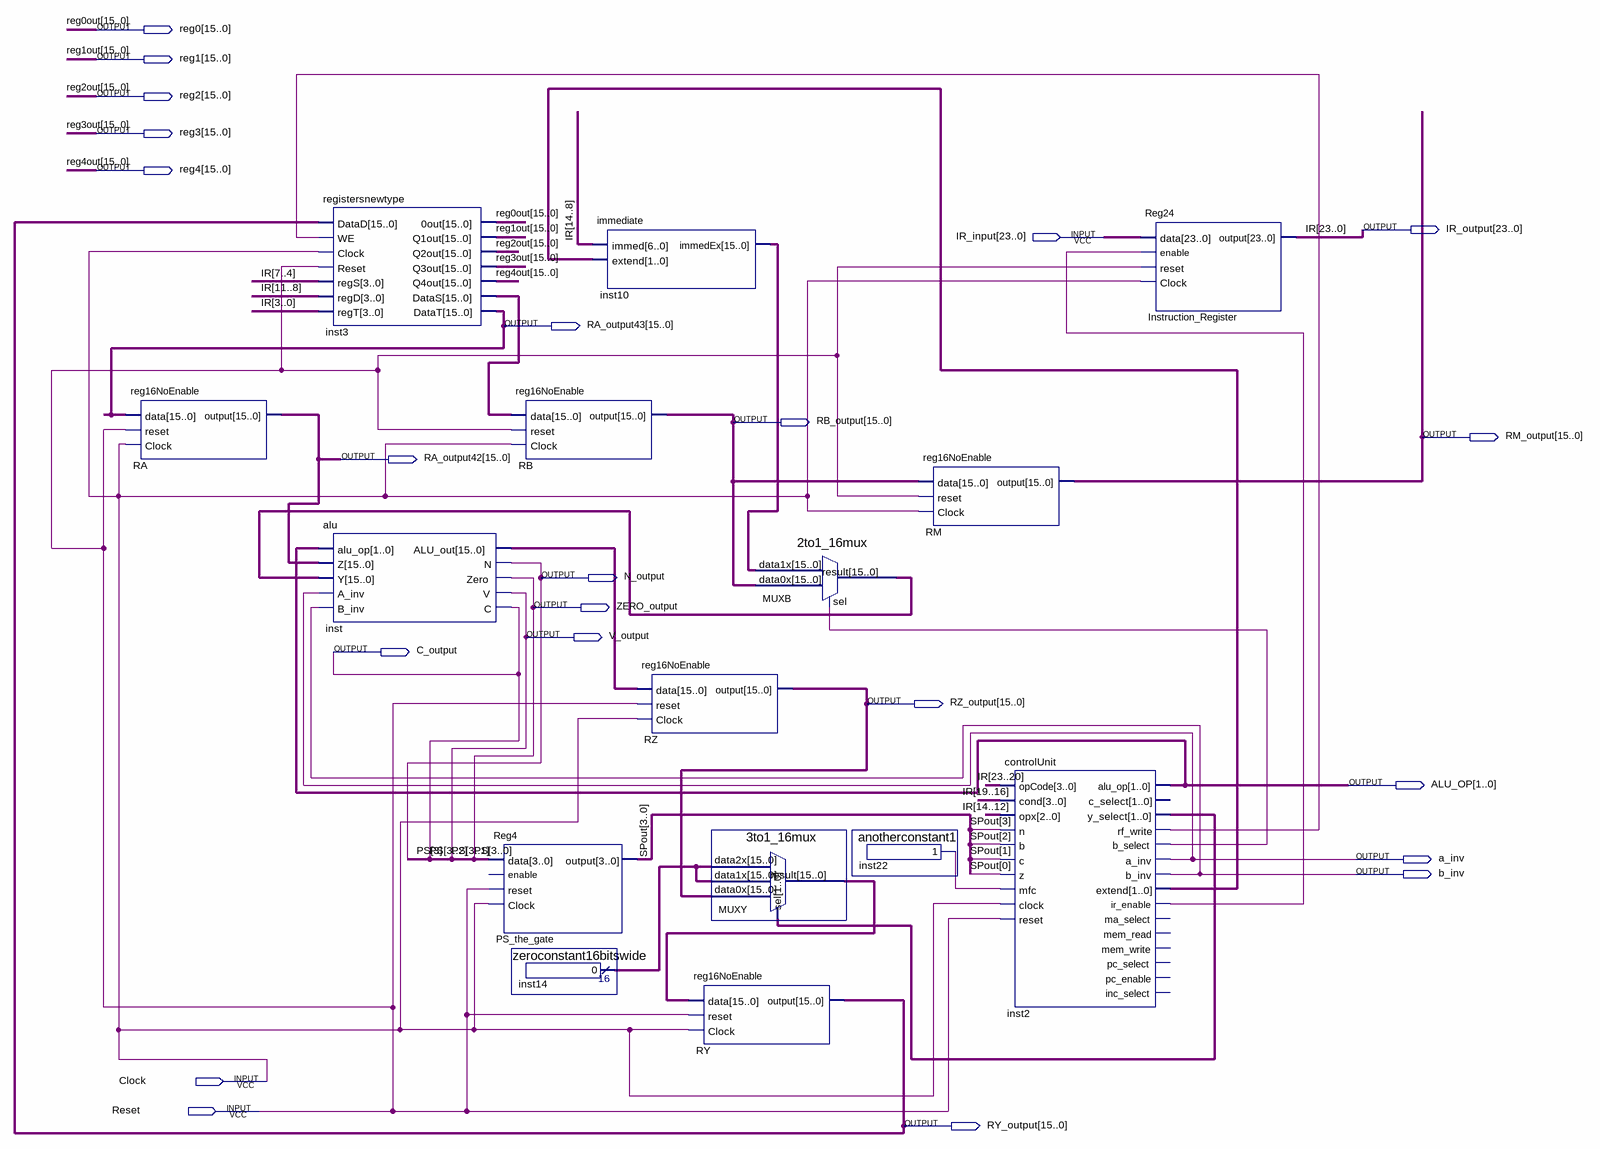
[diagram p0: schematic sheet]
// Quartus schematic ProjectMid.bdf as structural Verilog: 15 symbols, 22 pins
module ProjectMid (
  input  [23:0] IR_input,
  input  Clock,
  input  Reset,
  output [15:0] reg0,
  output [15:0] reg1,
  output [15:0] reg2,
  output [15:0] reg3,
  output [15:0] reg4,
  output [23:0] IR_output,
  output [15:0] RA_output43,
  output [15:0] RB_output,
  output [15:0] RM_output,
  output [15:0] RA_output42,
  output N_output,
  output ZERO_output,
  output V_output,
  output C_output,
  output [15:0] RZ_output,
  output [1:0] ALU_OP,
  output a_inv,
  output b_inv,
  output [15:0] RY_output
);

  wire inst2_b_select, inst2_ir_enable, inst2_rf_write, inst22_result;
  wire [1:0] inst2_extend, inst2_y_select;
  wire [3:0] PS, SPout;
  wire [15:0] inst3_datas, inst10_immedex, inst14_result, inst_alu_out, MUXB_result, MUXY_result;

  reg16NoEnable RA (.data(RA_output43), .reset(Reset), .Clock(Clock), .\output (RA_output42));
  registersnewtype inst3 (
    .DataD(RY_output), .WE(inst2_rf_write), .Clock(Clock), .Reset(Reset), .regS(IR_output[7:4]),
    .regD(IR_output[11:8]), .regT(IR_output[3:0]), .\0out (reg0), .Q1out(reg1), .Q2out(reg2), .Q3out(reg3),
    .Q4out(reg4), .DataS(inst3_datas), .DataT(RA_output43));
  alu inst (
    .alu_op(ALU_OP), .Z(RA_output42), .Y(MUXB_result), .A_inv(a_inv), .B_inv(b_inv), .ALU_out(inst_alu_out),
    .N(N_output), .Zero(ZERO_output), .V(V_output), .C(C_output));
  Reg4 PS_the_gate (.data(PS), .reset(Reset), .Clock(Clock), .\output (SPout));  // open: enable
  reg16NoEnable RB (.data(inst3_datas), .reset(Reset), .Clock(Clock), .\output (RB_output));
  zeroconstant16bitswide inst14 (.result(inst14_result));
  immediate inst10 (.immed(IR_output[14:8]), .extend(inst2_extend), .immedEx(inst10_immedex));
  reg16NoEnable RZ (.data(inst_alu_out), .reset(Reset), .Clock(Clock), .\output (RZ_output));
  \3to1_16mux  MUXY (
    .data2x(inst14_result), .data1x(inst14_result), .data0x(RZ_output), .sel(inst2_y_select),
    .result(MUXY_result));
  reg16NoEnable RY (.data(MUXY_result), .reset(Reset), .Clock(Clock), .\output (RY_output));
  \2to1_16mux  MUXB (.data1x(inst10_immedex), .data0x(RB_output), .sel(inst2_b_select), .result(MUXB_result));
  anotherconstant1 inst22 (.result(inst22_result));
  reg16NoEnable RM (.data(RB_output), .reset(Reset), .Clock(Clock), .\output (RM_output));
  controlUnit inst2 (
    .opCode(IR_output[23:20]), .cond(IR_output[19:16]), .opx(IR_output[14:12]), .n(SPout[3]), .b(SPout[2]),
    .c(SPout[1]), .z(SPout[0]), .mfc(inst22_result), .clock(Clock), .reset(Reset), .alu_op(ALU_OP),
    .y_select(inst2_y_select), .rf_write(inst2_rf_write), .b_select(inst2_b_select), .a_inv(a_inv),
    .b_inv(b_inv), .extend(inst2_extend), .ir_enable(inst2_ir_enable));  // open: c_select, ma_select, mem_read, mem_write, pc_select, pc_enable, inc_select
  Reg24 Instruction_Register (
    .data(IR_input), .enable(inst2_ir_enable), .reset(Reset), .Clock(Clock), .\output (IR_output));

  // Other names for the same wires on the sheet: IR[23:0] = IR_output; reg0out[15:0] = reg0; reg1out[15:0] = reg1;
  //   reg2out[15:0] = reg2; reg3out[15:0] = reg3; reg4out[15:0] = reg4
endmodule
